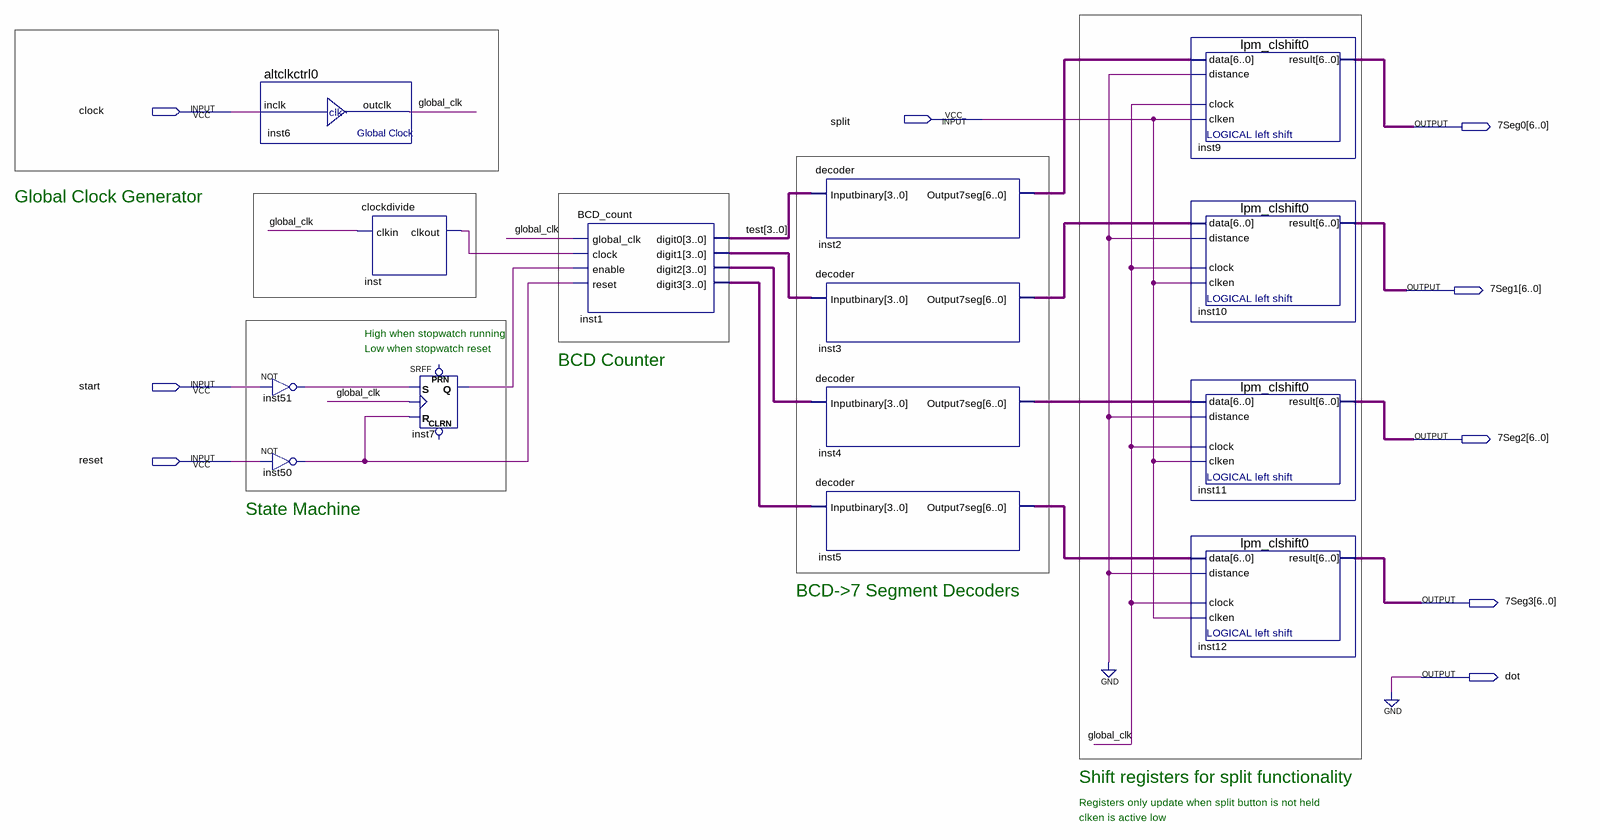
[diagram p0: schematic sheet]
// Quartus schematic stopwatch.bdf as structural Verilog: 14 symbols, 9 pins
module stopwatch (
  input  clock,
  input  split,
  input  start,
  input  reset,
  output [6:0] \7Seg0 ,
  output [6:0] \7Seg1 ,
  output [6:0] \7Seg2 ,
  output [6:0] \7Seg3 ,
  output dot
);

  wire global_clk, inst7_q, inst50_out, inst51_out, inst_clkout;
  wire [3:0] inst1_digit1, inst1_digit2, inst1_digit3, test;
  wire [6:0] inst2_output7seg, inst3_output7seg, inst4_output7seg, inst5_output7seg;

  altclkctrl0 inst6 (.inclk(clock), .outclk(global_clk));
  not inst51 (inst51_out, start);
  not inst50 (inst50_out, reset);
  clockdivide inst (.clkin(global_clk), .clkout(inst_clkout));
  SRFF inst7 (.S(inst51_out), .R(inst50_out), .CLK(global_clk), .Q(inst7_q));  // open: PRN, CLRN
  BCD_count inst1 (
    .global_clk(global_clk), .clock(inst_clkout), .enable(inst7_q), .reset(inst50_out), .digit0(test),
    .digit1(inst1_digit1), .digit2(inst1_digit2), .digit3(inst1_digit3));
  decoder inst2 (.Inputbinary(test), .Output7seg(inst2_output7seg));
  decoder inst3 (.Inputbinary(inst1_digit1), .Output7seg(inst3_output7seg));
  decoder inst4 (.Inputbinary(inst1_digit2), .Output7seg(inst4_output7seg));
  decoder inst5 (.Inputbinary(inst1_digit3), .Output7seg(inst5_output7seg));
  lpm_clshift0 inst9 (.data(inst2_output7seg), .distance(1'b0), .clock(global_clk), .clken(split), .result(\7Seg0 ));
  lpm_clshift0 inst10 (.data(inst3_output7seg), .distance(1'b0), .clock(global_clk), .clken(split), .result(\7Seg1 ));
  lpm_clshift0 inst11 (.data(inst4_output7seg), .distance(1'b0), .clock(global_clk), .clken(split), .result(\7Seg2 ));
  lpm_clshift0 inst12 (.data(inst5_output7seg), .distance(1'b0), .clock(global_clk), .clken(split), .result(\7Seg3 ));

  assign dot = 1'b0;

  // Notes on the sheet:
  //   Global Clock Generator
  //   High when stopwatch running
  //   Low when stopwatch reset
  //   BCD Counter
  //   State Machine
  //   BCD->7 Segment Decoders
  //   Shift registers for split functionality
  //   Registers only update when split button is not held
  //   clken is active low
endmodule
